# EAGLE schematic INTERFACE_MK20DX128VFM5 (EAGLE 7.6.0)
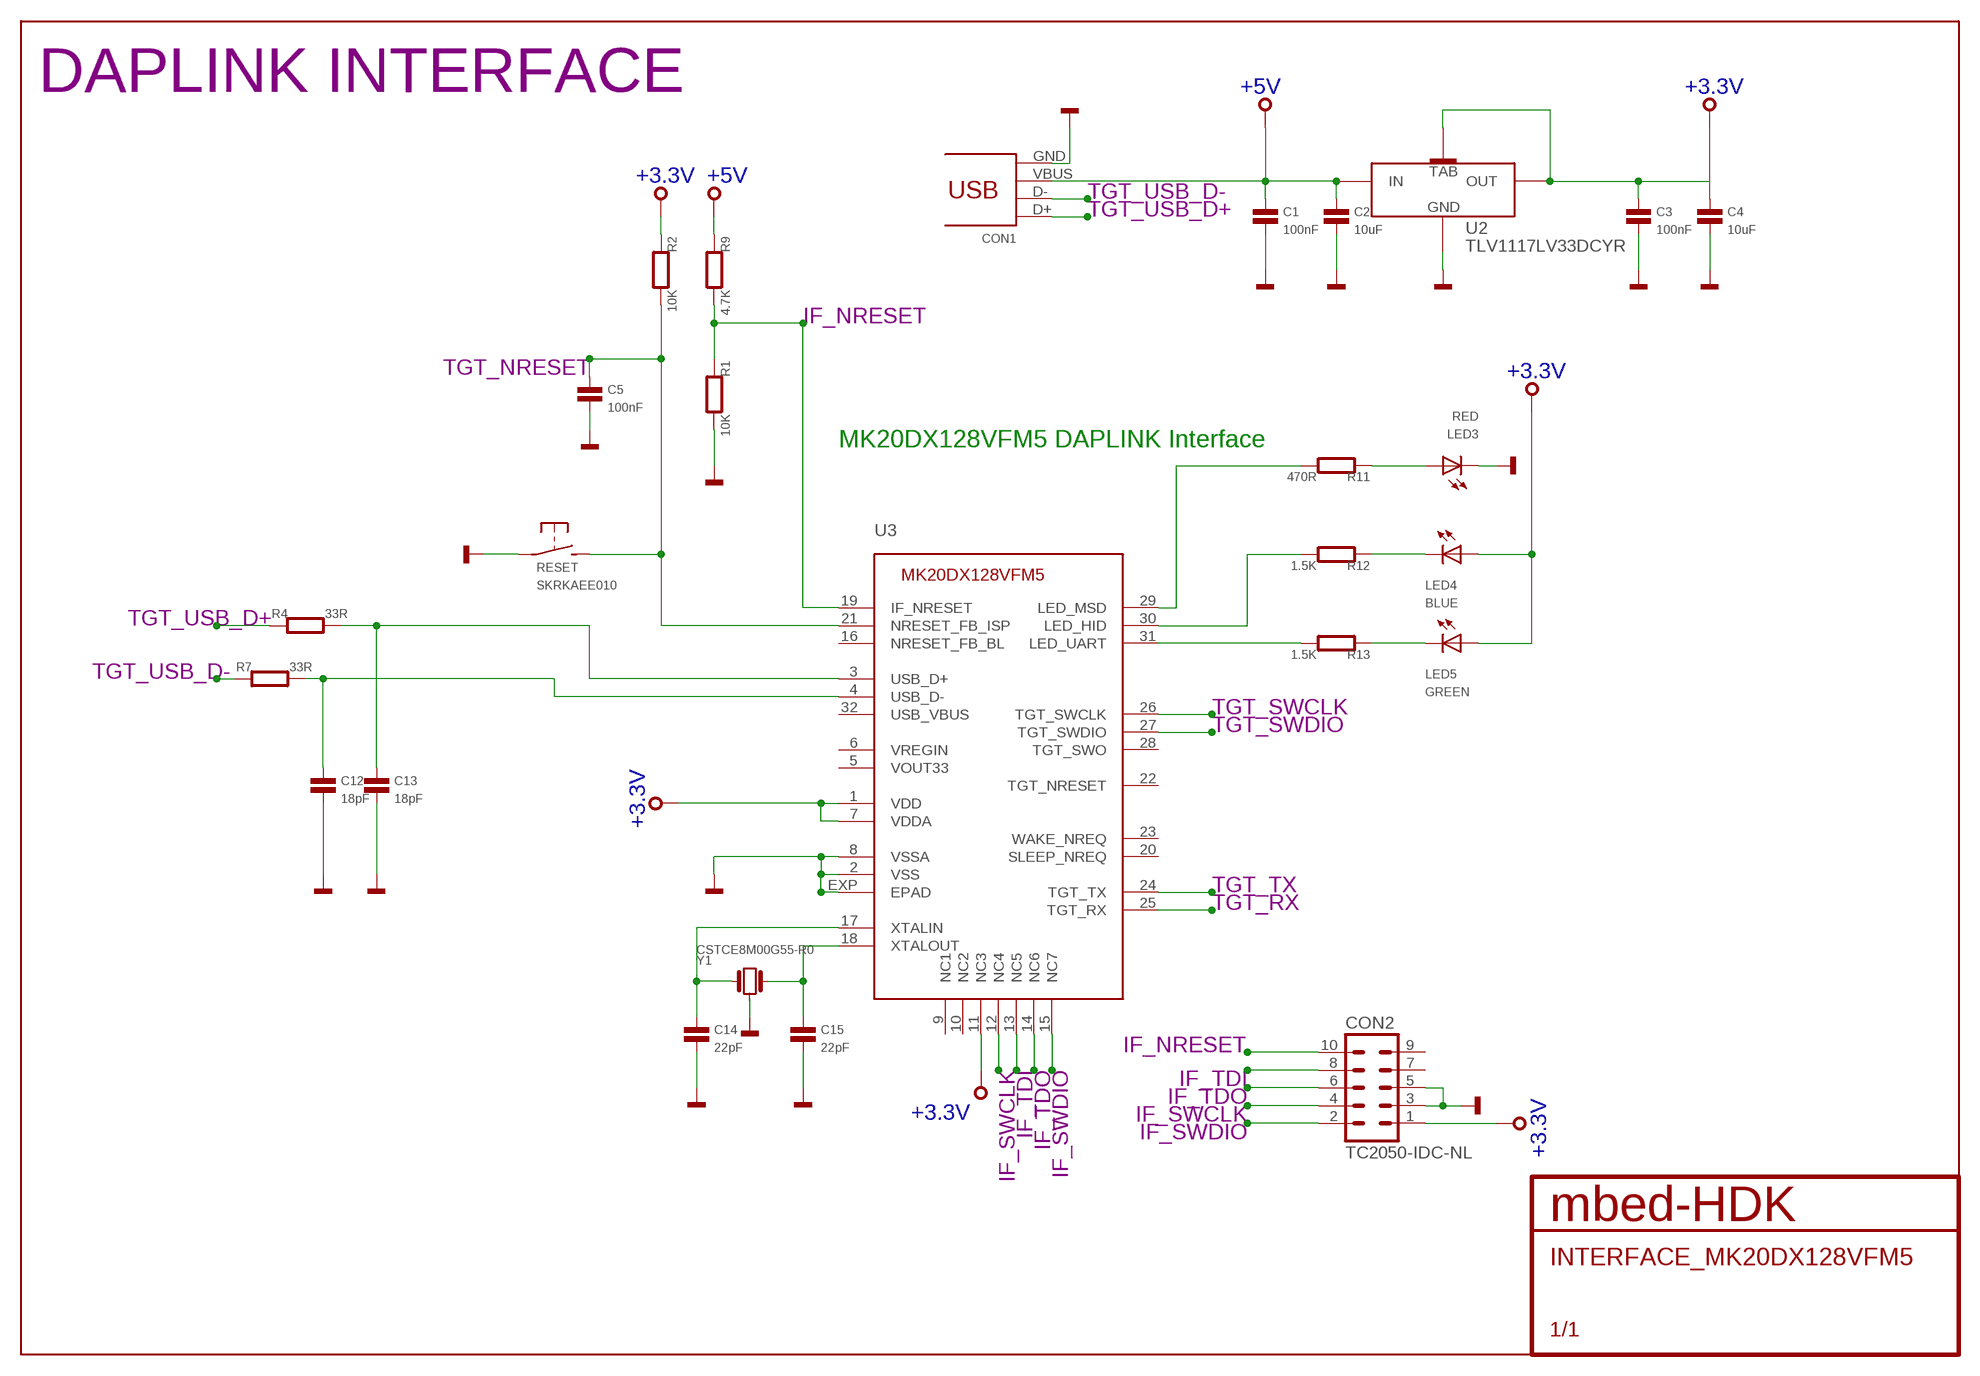
[diagram p0: schematic, sheet 1]

## Parts
C1  100nF  CAPACITOR0402  [0402]
C2  10uF  CAPACITOR0603  [0603]
C3  100nF  CAPACITOR0402  [0402]
C4  10uF  CAPACITOR0603  [0603]
C5  100nF  CAPACITOR0402  [0402]
C12  18pF  CAPACITOR0402  [0402]
C13  18pF  CAPACITOR0402  [0402]
C14  22pF  CAPACITOR0402  [0402]
C15  22pF  CAPACITOR0402  [0402]
CON1  47346-0001  [USB-MICRO-B-H]
CON2  TC2050-IDC-NL  [TC2050-IDC-NL]
LED3  RED  SMD_LED0603  [CHIPLED_0603]
LED4  BLUE  SMD_LED0603  [CHIPLED_0603]
LED5  GREEN  SMD_LED0603  [CHIPLED_0603]
R1  10K  RESISTOR0402  [0402]
R2  10K  RESISTOR0402  [0402]
R4  33R  RESISTOR0402  [0402]
R7  33R  RESISTOR0402  [0402]
R9  4.7K  RESISTOR0402  [0402]
R11  470R  RESISTOR0402  [0402]
R12  1.5K  RESISTOR0402  [0402]
R13  1.5K  RESISTOR0402  [0402]
RESET  SKRKAEE010  [SKRKAEE010]
U2  TLV1117LV33DCYR  [SOT223]
U3  IF_MK20DX128VFM5  [HVQFN33]
Y1  CSTCE8M00G55-R0  [CSTCE8M00G55-R0]

## Nets
+3.3V: C3.1 C4.1 CON2.1 LED4.A LED5.A R2.1 U2.OUT(1)(OUT) U2.OUT(2)(TAB) U3.1(VDD) U3.7(VDDA) U3.11(NC3)
+5V: C1.1 C2.1 CON1.VBUS R9.1 U2.IN
GND: C1.2 C2.2 C3.2 C4.2 C5.2 C12.2 C13.2 C14.2 C15.2 CON1.GND CON2.3 CON2.5 LED3.C R1.2 RESET.P$1(P) U2.GND U3.2(VSS) U3.8(VSSA) U3.EXP(EPAD) Y1.2
HID: R12.2 U3.30(LED_HID)
IF_NRESET: CON2.10 R1.1 R9.2 U3.19(IF_NRESET)
IF_SWCLK: CON2.4 U3.12(NC4)
IF_SWDIO: CON2.2 U3.15(NC7)
IF_TDI: CON2.8 U3.13(NC5)
IF_TDO: CON2.6 U3.14(NC6)
MSD: R11.2 U3.29(LED_MSD)
N$1: LED3.A R11.1
N$21: C13.1 R4.2 U3.3(USB_D+)
N$24: C12.1 R7.2 U3.4(USB_D-)
N$35: LED4.C R12.1
N$36: LED5.C R13.1
N$37: C15.1 U3.18(XTALOUT) Y1.3
N$40: C14.1 U3.17(XTALIN) Y1.1
TGT_NRESET: C5.1 R2.2 RESET.P$2(S) U3.21(NRESET_FB_ISP)
TGT_RX: U3.25(TGT_RX)
TGT_SWCLK: U3.26(TGT_SWCLK)
TGT_SWDIO: U3.27(TGT_SWDIO)
TGT_TX: U3.24(TGT_TX)
TGT_USB_D+: CON1.D+ R4.1
TGT_USB_D-: CON1.D- R7.1
UART: R13.2 U3.31(LED_UART)
Unconnected: CON2.7 CON2.9 U3.5(VOUT33) U3.6(VREGIN) U3.9(NC1) U3.10(NC2) U3.16(NRESET_FB_BL) U3.20(SLEEP_NREQ) U3.22(TGT_NRESET) U3.23(WAKE_NREQ) U3.28(TGT_SWO) U3.32(USB_VBUS)

## Notes on the sheet
- DAPLINK INTERFACE
- MK20DX128VFM5 DAPLINK Interface

## Library data of the parts
C1 C3 C5 C12-C15 = mbed-HDK-RLCQ:CAPACITOR: Capacitor
C2 C4 = mbed-HDK-RLC:CAPACITOR: Capacitor
CON1 = mbed-HDK-Connector:47346-0001: USB Receptacle Horizontal Micro Type B; MF: MOLEX; MFN: 47346-0001; OC-MOUSER: 538-47346-0001; OC-NEWARK: 1568026
CON2 = mbed-HDK-Connector:TC2050-IDC: Tag-Connect In Circuit Programming & Debug Cable 10 Pin
LED3-LED5 = mbed-HDK-Optical:SMD_LED: LED SMD, Colour Red; MF: Wurth Electronics Inc; MFN: 150060RS75000; OC-DIGIKEY: 732-4978-1-ND; OC-MOUSER: 710-150060RS75000; OC-NEWARK: 2322071
R1 R2 R4 R7 R9 R11-R13 = mbed-HDK-RLCQ:RESISTOR: Resistor
RESET = mbed-HDK-Switch:SKRKAEE010: MOMENTARY SWITCH PUSH VERTICAL (SPST); MF: ALPS; MFN: SKRKAEE010; OC-MOUSER: 688-SKRKAE
U2 = mbed-HDK-Power:TLV1117LV33DCYR: LDO Fixed Regulator 3.3v, 1A; MF: Texas Instruments; MFN: TLV1117LV33DCYR; OC-DIGIKEY: 296-28778-1-ND; OC-MOUSER: 595-TLV1117LV33DCYR; OC-NEWARK: 2323647
U3 = mbed-HDK-MF-NXP:IF_MK20DX128VFM5: CMSIS-DAP Interface : 32-bit K20 ARM Cortex M4 RISC 128KB Flash 1.8V/2.5V/3.3V 32-Pin QFN; MF: NXP; MFN: MK20DX128VFM5; OC-DIGIKEY: MK20DX128VFM5-ND; OC-MOUSER: 841-MK20DX128VFM5; OC-NEWARK: 2133567
Y1 = mbed-HDK-Oscillator:CSTCE8M00G55-R0: Resonator Cermanic, Murata 8MHz 33pF; MF: Murata; MFN: CSTCE8M00G55-R0; OC-DIGIKEY: 490-1195-1-ND; OC-MOUSER: 81-CSTCE8M00G55-R0; OC-NEWARK: 2443270